# EAGLE design SC70-6-minimal (EAGLE 6.5.0)
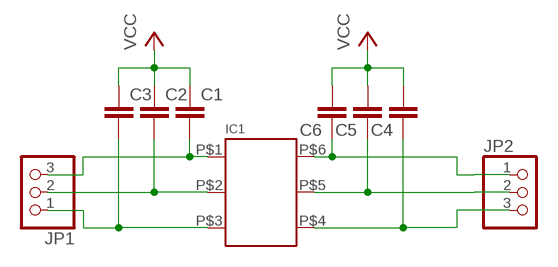
[diagram p0: schematic, sheet 1]

## Parts
C1  C-EUC0603  [C0603]
C2  C-EUC0603  [C0603]
C3  C-EUC0603  [C0603]
C4  C-EUC0603  [C0603]
C5  C-EUC0603  [C0603]
C6  C-EUC0603  [C0603]
IC1  FOOTPRINT-6-PINSC70  [SC-70/6]
JP1  PINHD-1X3  [1X03]
JP2  PINHD-1X3  [1X03]

## Nets
1: C1.2 IC1.P$1 JP1.3
2: C2.2 IC1.P$2 JP1.2
3: C3.2 IC1.P$3 JP1.1
4: C4.1 IC1.P$4 JP2.3
5: C5.1 IC1.P$5 JP2.2
6: C6.1 IC1.P$6 JP2.1
VCC: C1.1 C2.1 C3.1 C4.2 C5.2 C6.2

## Library data of the parts
C1-C6 = p.peter-rcl:C-EU: CAPACITOR, European symbol
IC1 = p.peter-doc:FOOTPRINT-6-PIN
JP1 JP2 = pinhead:PINHD-1X3: PIN HEADER

## Board
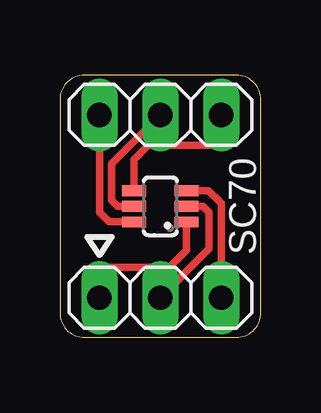
[diagram p1: board, top side]
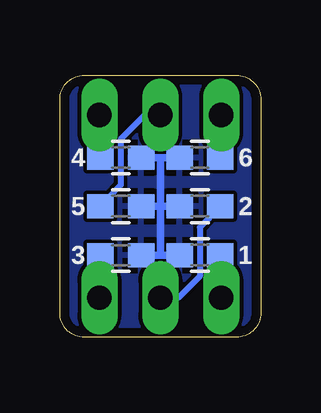
[diagram p2: board, bottom side, seen from below]

Size 8.38 x 10.92 mm. Coordinates in mm from the lower left corner, seen from the top.
Outline: 1.02,0 7.37,0 arc90 8.38,1.02 8.38,9.91 arc90 7.37,10.92 7.11,10.92 1.02,10.92 arc90 0,9.91 0,1.02 arc90 1.02,0
Copper layers (1*16): Top 0.0356mm / dielectric 1.5011mm / Bottom 0.0356mm
Design rules "oshpark": minimum track width 6mil, minimum drill 13mil, track to track 6mil, track to pad 6mil, pad to pad 6mil, via to via 6mil, smd to smd 6mil, copper to edge 15mil, drill to drill 6mil, minimum pad ring 7mil, minimum via ring 7mil, stop-mask expansion 4mil, vias tented up to drill 4.1mm, thermal gap 10mil

### Footprints (pad centres in the part's own frame; a part is rotated, then mirrored left to right if it is on the bottom)
C0603 = smd 1.1 x 1: 1 -0.85,0; 2 0.85,0
SC-70/6 = smd 0.45 x 1: P$1 -0.65,-1.1; P$2 0,-1.1; P$3 0.65,-1.1; P$4 0.65,1.1; P$5 0,1.1; P$6 -0.65,1.1
1X03 = drill 1.016 long: 1 -2.54,0; 2 0,0; 3 2.54,0

### Placement (x,y rotation side)
C1  2.54,3.43 0 bottom
C2  2.54,5.46 0 bottom
C3  5.84,3.43 180 bottom
C4  5.84,7.49 0 bottom
C5  5.84,5.46 0 bottom
C6  2.54,7.49 180 bottom
IC1  4.19,5.46 90 top
JP1  4.19,1.65 180 top
JP2  4.19,9.27 0 top

### Tracks (layer width: path | path; a pad name or v marks a point on that pad's centre or on a via)
1
  Top 0.305: IC1.P$1 5.29,3.64 4.57,2.92 2.03,2.92 1.65,2.54 JP1.3
  Bottom 0.254: C1.2 1.65,3.43 JP1.3
2
  Top 0.305: IC1.P$2 5.97,5.46 6.22,5.21 6.22,3.68 JP1.2
  Bottom 0.254: C2.2 1.78,5.46 2.16,4.95 2.54,4.57 2.54,2.54 3.43,1.65 JP1.2
3
  Top 0.305: IC1.P$3 6.21,6.11 6.73,5.59 JP1.1
  Bottom 0.305: C3.2 6.73,3.43 JP1.1
4
  Top 0.305: IC1.P$4 3.09,7.41 3.68,8 6.35,8 6.73,8.38 6.73,9.14 JP2.3
  Bottom 0.305: C4.1 6.73,7.49 JP2.3
5
  Top 0.305: IC1.P$5 2.41,5.46 2.16,5.71 2.16,7.24 3.43,8.51 JP2.2
  Bottom 0.254: C5.1 6.69,5.5 6.35,5.84 5.84,6.35 5.84,8.25 4.83,9.27 JP2.2
6
  Top 0.305: IC1.P$6 2.05,4.81 1.65,5.21 1.65,9.02 JP2.1
  Bottom 0.254: C6.1 1.65,7.49 JP2.1
VCC
  Bottom 0.254: C6.2 4.19,7.49 4.19,5.46
  Bottom 0.305: C3.1 4.19,3.43 | 4.19,3.43 C1.1 | C5.2 4.19,5.46 | 4.19,5.46 C2.1 | 4.19,7.49 C4.2 4.19,7.49 | 4.19,7.49 C6.2 | 4.19,7.49 4.19,5.46 | 4.19,5.46 4.19,3.43
  pour Bottom: -0.25,-0.25 -0.25,11.18 8.64,11.18 8.64,-0.25

### Text on the board
tPlace: SC70
bPlace: 6 | 4 | 2 | 5 | 1 | 3